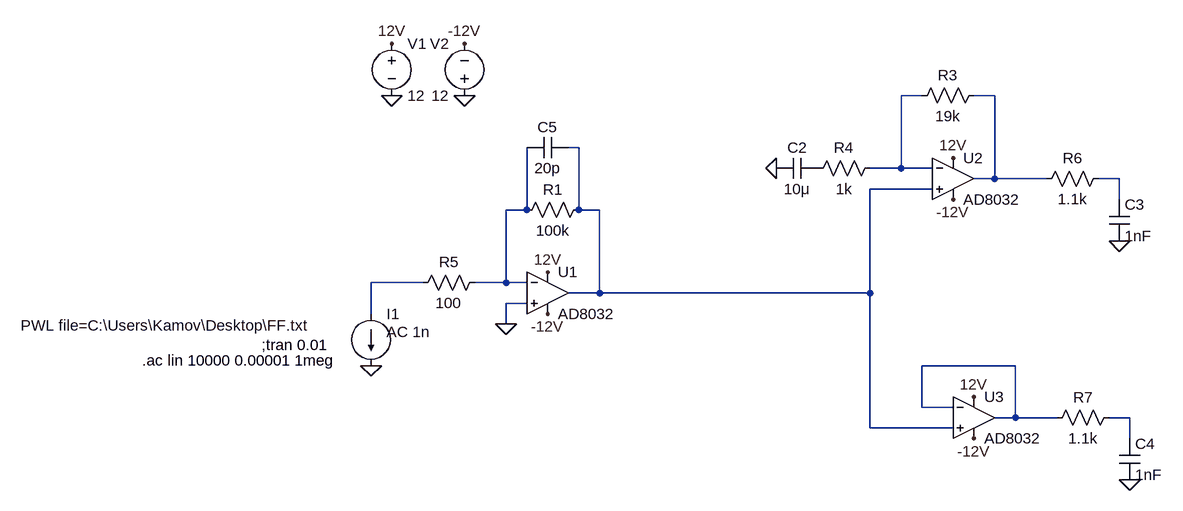
[diagram p0: schematic Draft1.asc]
Draft1.asc, the LTspice schematic file:
Version 4
SHEET 1 1364 680
WIRE 672 0 640 0
WIRE 784 0 752 0
WIRE 144 80 128 80
WIRE 640 112 640 0
WIRE 640 112 592 112
WIRE 688 112 640 112
WIRE 784 128 784 0
WIRE 784 128 752 128
WIRE 864 128 784 128
WIRE 976 128 944 128
WIRE 688 144 592 144
WIRE 976 160 976 128
WIRE 64 176 64 80
WIRE 64 176 32 176
WIRE 144 176 144 80
WIRE 176 176 144 176
WIRE -96 288 -176 288
WIRE 32 288 32 176
WIRE 32 288 -16 288
WIRE 64 288 32 288
WIRE 176 304 176 176
WIRE 176 304 128 304
WIRE 592 304 592 144
WIRE 592 304 176 304
WIRE 64 320 32 320
WIRE -176 336 -176 288
WIRE 32 352 32 320
WIRE 816 416 672 416
WIRE 672 480 672 416
WIRE 720 480 672 480
WIRE 816 496 816 416
WIRE 816 496 784 496
WIRE 880 496 816 496
WIRE 992 496 960 496
WIRE 592 512 592 304
WIRE 720 512 592 512
WIRE 992 528 992 496
FLAG -176 416 0
FLAG -144 0 0
FLAG -32 0 0
FLAG -144 -80 12V
FLAG -32 -80 -12V
FLAG 96 336 -12V
FLAG 96 272 12V
FLAG 32 352 0
FLAG 720 96 12V
FLAG 720 160 -12V
FLAG 448 112 0
FLAG 752 464 12V
FLAG 752 528 -12V
FLAG 976 224 0
FLAG 992 592 0
SYMBOL current -176 336 R0
WINDOW 3 -539 18 Left 2
WINDOW 123 24 28 Left 2
WINDOW 39 0 0 Left 0
SYMATTR Value PWL file=C:\Users\Kamov\Desktop\FF.txt
SYMATTR Value2 AC 1n
SYMATTR InstName I1
SYMBOL OpAmps\\AD8032 96 240 R0
SYMATTR InstName U1
SYMBOL voltage -144 -96 R0
WINDOW 123 0 0 Left 0
WINDOW 39 0 0 Left 0
SYMATTR InstName V1
SYMATTR Value 12
SYMBOL voltage -32 16 R180
WINDOW 0 24 96 Left 2
WINDOW 3 24 16 Left 2
WINDOW 123 0 0 Left 0
WINDOW 39 0 0 Left 0
SYMATTR InstName V2
SYMATTR Value 12
SYMBOL res 160 160 R90
WINDOW 0 0 56 VBottom 2
WINDOW 3 32 56 VTop 2
SYMATTR InstName R1
SYMATTR Value 100k
SYMBOL OpAmps\\AD8032 720 64 R0
SYMATTR InstName U2
SYMBOL res 768 -16 R90
WINDOW 0 0 56 VBottom 2
WINDOW 3 32 56 VTop 2
SYMATTR InstName R3
SYMATTR Value 19k
SYMBOL res 608 96 R90
WINDOW 0 0 56 VBottom 2
WINDOW 3 32 56 VTop 2
SYMATTR InstName R4
SYMATTR Value 1k
SYMBOL cap 512 96 R90
WINDOW 0 0 32 VBottom 2
WINDOW 3 32 32 VTop 2
SYMATTR InstName C2
SYMATTR Value 10μ
SYMBOL OpAmps\\AD8032 752 432 R0
SYMATTR InstName U3
SYMBOL res 0 272 R90
WINDOW 0 0 56 VBottom 2
WINDOW 3 32 56 VTop 2
SYMATTR InstName R5
SYMATTR Value 100
SYMBOL res 960 112 R90
WINDOW 0 0 56 VBottom 2
WINDOW 3 32 56 VTop 2
SYMATTR InstName R6
SYMATTR Value 1.1k
SYMBOL cap 960 160 R0
SYMATTR InstName C3
SYMATTR Value 1nF
SYMBOL res 976 480 R90
WINDOW 0 0 56 VBottom 2
WINDOW 3 32 56 VTop 2
SYMATTR InstName R7
SYMATTR Value 1.1k
SYMBOL cap 976 528 R0
SYMATTR InstName C4
SYMATTR Value 1nF
SYMBOL cap 128 64 R90
WINDOW 0 0 32 VBottom 2
WINDOW 3 32 32 VTop 2
SYMATTR InstName C5
SYMATTR Value 20p
TEXT -344 384 Left 2 !;tran 0.01
TEXT -528 408 Left 2 !.ac lin 10000 0.00001 1meg

The netlist it stands for:
* Draft1.asc
I1 N006 0 PWL file=C:\Users\Kamov\Desktop\FF.txt AC 1n
XU1 0 N005 12V -12V N003 AD8032  ; pins In+ In- V+ V- OUT
V1 12V 0 12
V2 0 -12V 12
R1 N003 N005 100k
XU2 N003 N001 12V -12V N002 AD8032  ; pins In+ In- V+ V- OUT
R3 N002 N001 19k
R4 N001 P001 1k
C2 P001 0 10μ
XU3 N003 N007 12V -12V N007 AD8032  ; pins In+ In- V+ V- OUT
R5 N005 N006 100
R6 N004 N002 1.1k
C3 N004 0 1nF
R7 N008 N007 1.1k
C4 N008 0 1nF
C5 N003 N005 20p
;tran 0.01
.ac lin 10000 0.00001 1meg
.backanno
.end